# EAGLE design PUCY_E3_wzor (EAGLE 5.08)
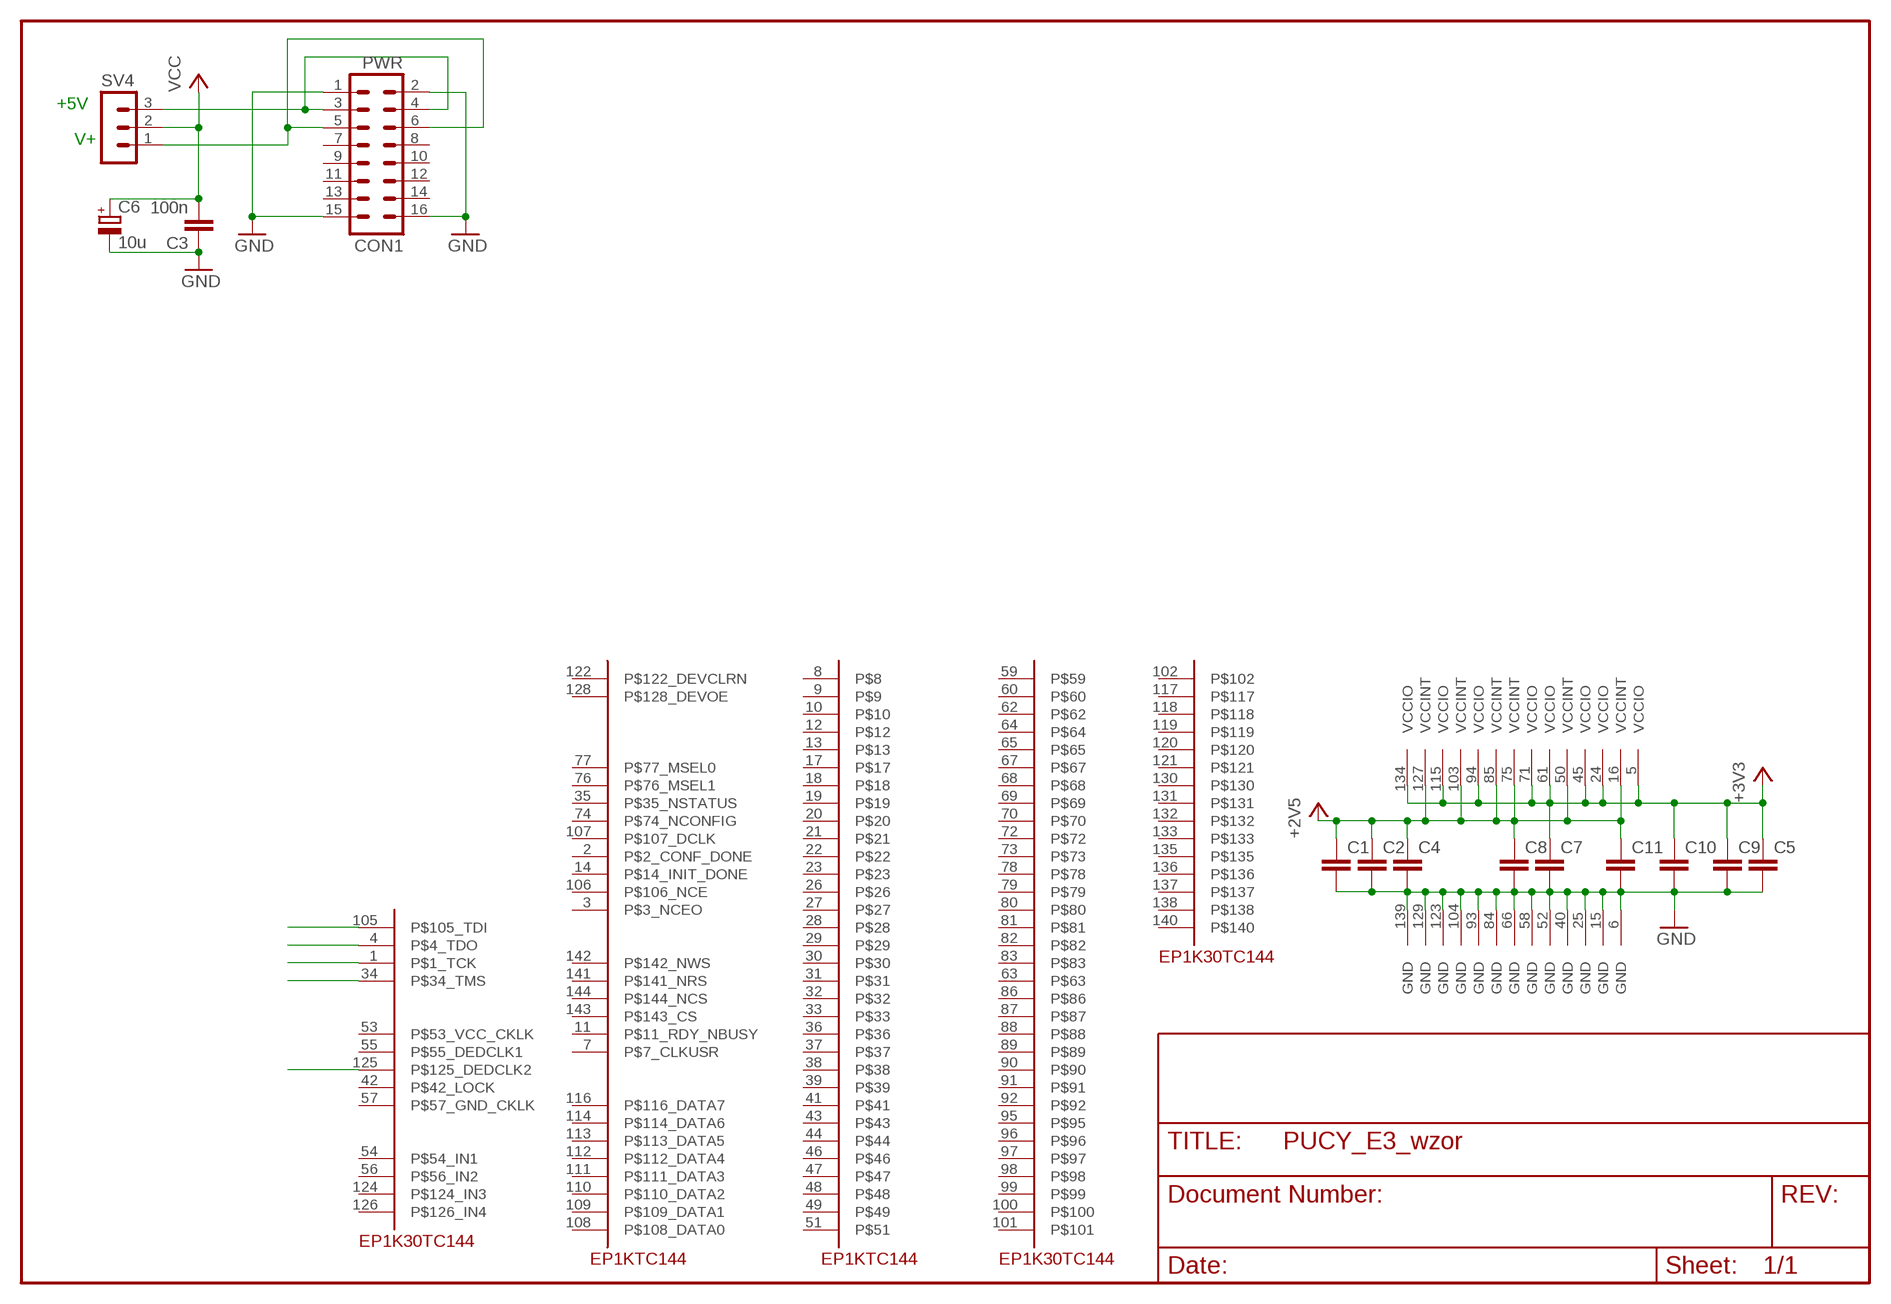
[diagram p0: schematic, sheet 1]

## Parts
C1  C-EUC0805  [C0805]
C2  C-EUC0805  [C0805]
C3  100n  C-EUC0805  [C0805]
C4  C-EUC0805  [C0805]
C5  C-EUC0805  [C0805]
C6  10u  CPOL-EUB/3528-21W  [B/3528-21W]
C7  C-EUC0805  [C0805]
C8  C-EUC0805  [C0805]
C9  C-EUC0805  [C0805]
C10  C-EUC0805  [C0805]
C11  C-EUC0805  [C0805]
CON1  PWR  ML16  [ML16]
SV4  MA03-1  [MA03-1]
U$1  PAWLA_EP1K30TC144  [PAWLA_TQFP144]

## Nets
+3V3: C5.1 C7.1 C9.1 C10.1 U$1.5(VCCIO) U$1.24(VCCIO) U$1.45(VCCIO) U$1.61(VCCIO) U$1.71(VCCIO) U$1.94(VCCIO) U$1.115(VCCIO) U$1.134(VCCIO)
+5V: C1.1 C2.1 C4.1 C8.1 C11.1 U$1.16(VCCINT) U$1.50(VCCINT) U$1.75(VCCINT) U$1.85(VCCINT) U$1.103(VCCINT) U$1.127(VCCINT) ; supply symbol labelled +2V5
GND: C1.2 C2.2 C3.1 C4.2 C5.2 C6.- C7.2 C8.2 C9.2 C10.2 C11.2 CON1.1 CON1.2 CON1.15 CON1.16 U$1.6(GND) U$1.15(GND) U$1.25(GND) U$1.40(GND) U$1.52(GND) U$1.58(GND) U$1.66(GND) U$1.84(GND) U$1.93(GND) U$1.104(GND) U$1.123(GND) U$1.129(GND) U$1.139(GND)
N$1: U$1.125(P$125_DEDCLK2)
N$3: U$1.1(P$1_TCK)
N$4: CON1.5 CON1.6 SV4.1
N$5: U$1.34(P$34_TMS)
N$6: U$1.4(P$4_TDO)
N$7: U$1.105(P$105_TDI)
N$8: CON1.3 CON1.4 SV4.3
VCC: C3.2 C6.+ SV4.2
Unconnected: CON1.7 CON1.8 CON1.9 CON1.10 CON1.11 CON1.12 CON1.13 CON1.14 U$1.2(P$2_CONF_DONE) U$1.3(P$3_NCEO) U$1.7(P$7_CLKUSR) U$1.8 U$1.9 U$1.10 U$1.11(P$11_RDY_NBUSY) U$1.12 U$1.13 U$1.14(P$14_INIT_DONE) U$1.17 U$1.18 U$1.19 U$1.20 U$1.21 U$1.22 U$1.23 U$1.26 U$1.27 U$1.28 U$1.29 U$1.30 U$1.31 U$1.32 U$1.33 U$1.35(P$35_NSTATUS) U$1.36 U$1.37 U$1.38 U$1.39 U$1.41 U$1.42(P$42_LOCK) U$1.43 U$1.44 U$1.46 U$1.47 U$1.48 U$1.49 U$1.51 U$1.53(P$53_VCC_CKLK) U$1.54(P$54_IN1) U$1.55(P$55_DEDCLK1) U$1.56(P$56_IN2) U$1.57(P$57_GND_CKLK) U$1.59 U$1.60 U$1.62 U$1.63 U$1.64 U$1.65 U$1.67 U$1.68 U$1.69 U$1.70 U$1.72 U$1.73 U$1.74(P$74_NCONFIG) U$1.76(P$76_MSEL1) U$1.77(P$77_MSEL0) U$1.78 U$1.79 U$1.80 U$1.81 U$1.82 U$1.83 U$1.86 U$1.87 U$1.88 U$1.89 U$1.90 U$1.91 U$1.92 U$1.95 U$1.96 U$1.97 U$1.98 U$1.99 U$1.100 U$1.101 U$1.102 U$1.106(P$106_NCE) U$1.107(P$107_DCLK) U$1.108(P$108_DATA0) U$1.109(P$109_DATA1) U$1.110(P$110_DATA2) U$1.111(P$111_DATA3) U$1.112(P$112_DATA4) U$1.113(P$113_DATA5) U$1.114(P$114_DATA6) U$1.116(P$116_DATA7) U$1.117 U$1.118 U$1.119 U$1.120 U$1.121 U$1.122(P$122_DEVCLRN) U$1.124(P$124_IN3) U$1.126(P$126_IN4) U$1.128(P$128_DEVOE) U$1.130 U$1.131 U$1.132 U$1.133 U$1.135 U$1.136 U$1.137 U$1.138 U$1.140 U$1.141(P$141_NRS) U$1.142(P$142_NWS) U$1.143(P$143_CS) U$1.144(P$144_NCS)

## Notes on the sheet
- +5V
- V+

## Library data of the parts
C1 C2 C4 C5 C7-C11 = resistor:C-EU: CAPACITOR, European symbol
C3 = rcl:C-EU: CAPACITOR, European symbol
C6 = rcl:CPOL-EU: POLARIZED CAPACITOR, European symbol
CON1 = con-ml:ML16: HARTING
SV4 = con-lstb:MA03-1: PIN HEADER
U$1 = EP1K30TC144:PAWLA_EP1K30TC144

## Board
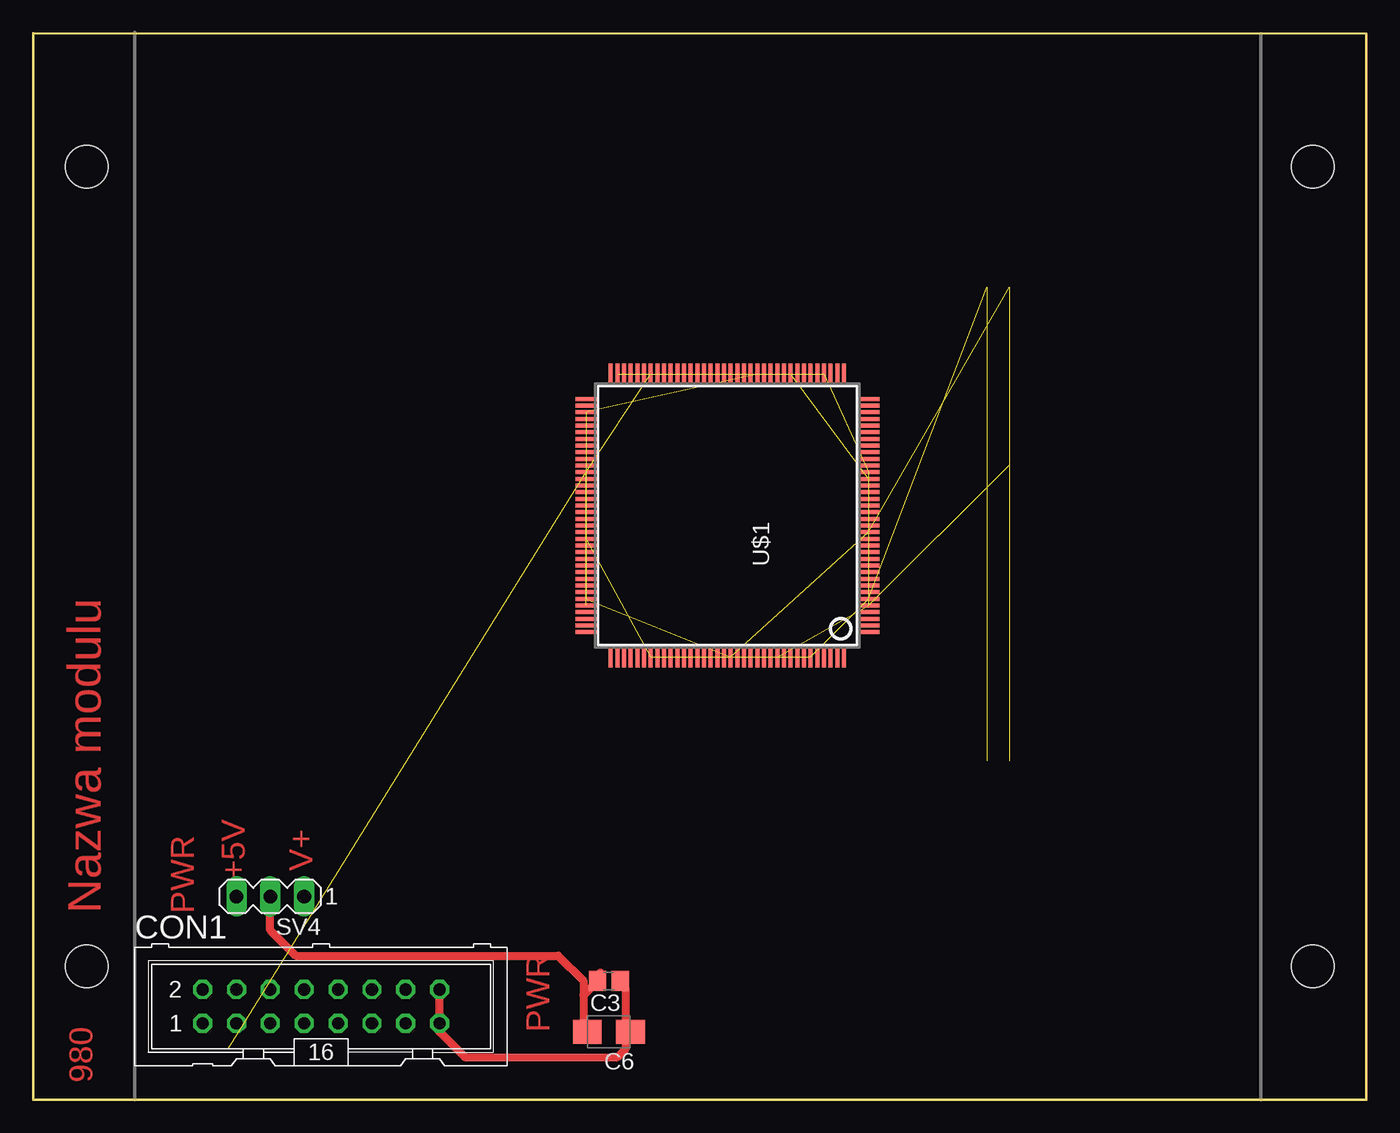
[diagram p1: board, top side]
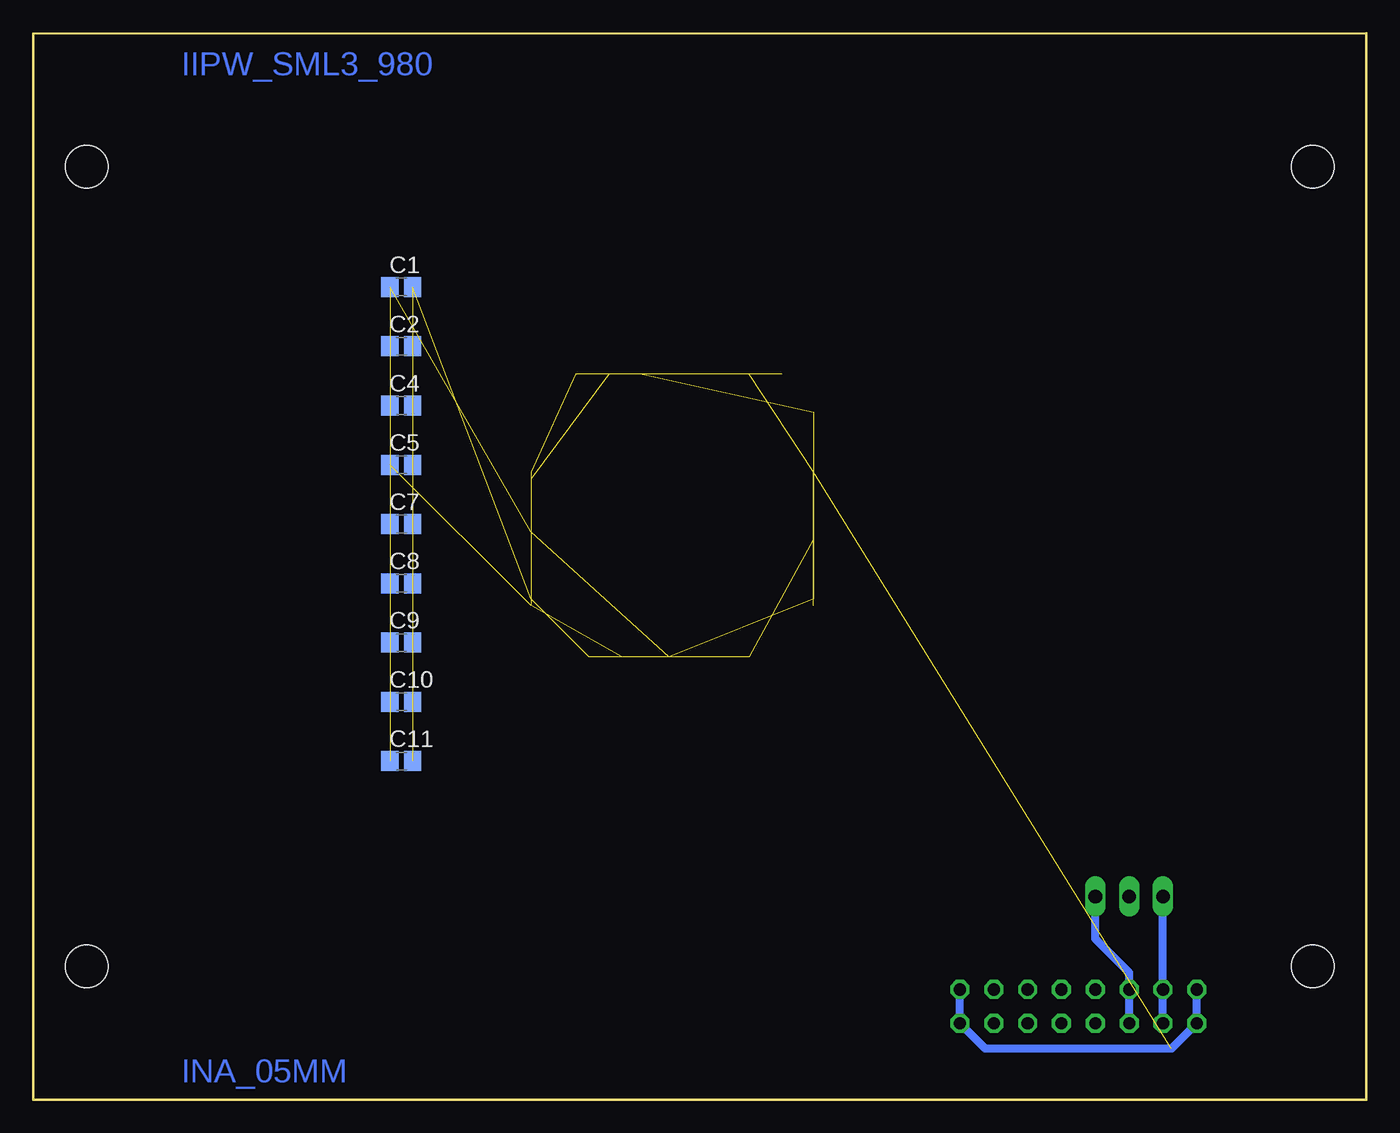
[diagram p2: board, bottom side, seen from below]

Size 100 x 80 mm. Coordinates in mm from the lower left corner, seen from the top.
Outline: 0,0 100,0 100,79.98 0,80 0,0
Copper layers (1*16): Top 0.035mm / dielectric 1.5mm / Bottom 0.035mm
Design rules "default": minimum track width 10mil, minimum drill 24mil, track to track 8mil, track to pad 8mil, pad to pad 8mil, via to via 8mil, smd to smd 8mil, copper to edge 40mil, drill to drill 8mil, minimum pad ring 10mil, minimum via ring 8mil, stop-mask expansion 4mil, vias tented up to drill 0mil, thermal gap 10mil
Holes 3.2 mm at 4,10 4,70 96,10 96,70

### Footprints (pad centres in the part's own frame; a part is rotated, then mirrored left to right if it is on the bottom)
C0805 = smd 1.3 x 1.5: 1 -0.85,0; 2 0.85,0
B/3528-21W = smd 2.15 x 1.8: + 1.625,0; - -1.625,0
ML16 = drill 0.914 octagon: 1 -8.89,-1.27; 2 -8.89,1.27; 3 -6.35,-1.27; 4 -6.35,1.27; 5 -3.81,-1.27; 6 -3.81,1.27; 7 -1.27,-1.27; 8 -1.27,1.27; 9 1.27,-1.27; 10 1.27,1.27; 11 3.81,-1.27; 12 3.81,1.27; 13 6.35,-1.27; 14 6.35,1.27; 15 8.89,-1.27; 16 8.89,1.27
MA03-1 = drill 1.016 long: 1 -2.54,0; 2 0,0; 3 2.54,0
PAWLA_TQFP144 = smd 0.3 x 1.6: 1 -8.75,-10.6; 2 -8.25,-10.6; 3 -7.75,-10.6; 4 -7.25,-10.6; 5 -6.75,-10.6; 6 -6.25,-10.6; 7 -5.75,-10.6; 8 -5.25,-10.6; 9 -4.75,-10.6; 10 -4.25,-10.6; 11 -3.75,-10.6; 12 -3.25,-10.6; 13 -2.75,-10.6; 14 -2.25,-10.6; 15 -1.75,-10.6; 16 -1.25,-10.6; 17 -0.75,-10.6; 18 -0.25,-10.6; 19 0.25,-10.6; 20 0.75,-10.6; 21 1.25,-10.6; 22 1.75,-10.6; 23 2.25,-10.6; 24 2.75,-10.6; 25 3.25,-10.6; 26 3.75,-10.6; 27 4.25,-10.6; 28 4.75,-10.6; 29 5.25,-10.6; 30 5.75,-10.6; 31 6.25,-10.6; 32 6.75,-10.6; 33 7.25,-10.6; 34 7.75,-10.6; 35 8.25,-10.6; 36 8.75,-10.6; 73 8.75,10.6; 74 8.25,10.6; 75 7.75,10.6; 76 7.25,10.6; 77 6.75,10.6; 78 6.25,10.6; 79 5.75,10.6; 80 5.25,10.6; 81 4.75,10.6; 82 4.25,10.6; 83 3.75,10.6; 84 3.25,10.6; 85 2.75,10.6; 86 2.25,10.6; 87 1.75,10.6; 88 1.25,10.6; 89 0.75,10.6; 90 0.25,10.6; 91 -0.25,10.6; 92 -0.75,10.6; 93 -1.25,10.6; 94 -1.75,10.6; 95 -2.25,10.6; 96 -2.75,10.6; 97 -3.25,10.6; 98 -3.75,10.6; 99 -4.25,10.6; 100 -4.75,10.6; 101 -5.25,10.6; 102 -5.75,10.6; 103 -6.25,10.6; 104 -6.75,10.6; 105 -7.25,10.6; 106 -7.75,10.6; 107 -8.25,10.6; 108 -8.75,10.6 | smd 1.6 x 0.3: 37 10.6,-8.75; 38 10.6,-8.25; 39 10.6,-7.75; 40 10.6,-7.25; 41 10.6,-6.75; 42 10.6,-6.25; 43 10.6,-5.75; 44 10.6,-5.25; 45 10.6,-4.75; 46 10.6,-4.25; 47 10.6,-3.75; 48 10.6,-3.25; 49 10.6,-2.75; 50 10.6,-2.25; 51 10.6,-1.75; 52 10.6,-1.25; 53 10.6,-0.75; 54 10.6,-0.25; 55 10.6,0.25; 56 10.6,0.75; 57 10.6,1.25; 58 10.6,1.75; 59 10.6,2.25; 60 10.6,2.75; 61 10.6,3.25; 62 10.6,3.75; 63 10.6,4.25; 64 10.6,4.75; 65 10.6,5.25; 66 10.6,5.75; 67 10.6,6.25; 68 10.6,6.75; 69 10.6,7.25; 70 10.6,7.75; 71 10.6,8.25; 72 10.6,8.75; 109 -10.6,8.75; 110 -10.6,8.25; 111 -10.6,7.75; 112 -10.6,7.25; 113 -10.6,6.75; 114 -10.6,6.25; 115 -10.6,5.75; 116 -10.6,5.25; 117 -10.6,4.75; 118 -10.6,4.25; 119 -10.6,3.75; 120 -10.6,3.25; 121 -10.6,2.75; 122 -10.6,2.25; 123 -10.6,1.75; 124 -10.6,1.25; 125 -10.6,0.75; 126 -10.6,0.25; 127 -10.6,-0.25; 128 -10.6,-0.75; 129 -10.6,-1.25; 130 -10.6,-1.75; 131 -10.6,-2.25; 132 -10.6,-2.75; 133 -10.6,-3.25; 134 -10.6,-3.75; 135 -10.6,-4.25; 136 -10.6,-4.75; 137 -10.6,-5.25; 138 -10.6,-5.75; 139 -10.6,-6.25; 140 -10.6,-6.75; 141 -10.6,-7.25; 142 -10.6,-7.75; 143 -10.6,-8.25; 144 -10.6,-8.75

### Placement (x,y rotation side)
C1  72.39,60.96 0 bottom
C2  72.39,56.52 0 bottom
C3  43.18,8.89 180 top
C4  72.39,52.07 0 bottom
C5  72.39,47.62 0 bottom
C6  43.18,5.08 180 top
C7  72.39,43.18 0 bottom
C8  72.39,38.73 0 bottom
C9  72.39,34.29 0 bottom
C10  72.39,29.84 0 bottom
C11  72.39,25.4 0 bottom
CON1  21.59,6.99 0 top
SV4  17.78,15.24 180 top
U$1  52.07,43.81 90 top

### Tracks (layer width: path | path; a pad name or v marks a point on that pad's centre or on a via)
+3V3  (11 unrouted)
+5V  (10 unrouted)
GND  (22 unrouted)
  Top 0.61: CON1.16 CON1.15 30.48,5.08 32.38,3.17 43.81,3.17 44.45,3.81 44.45,5.08 | 44.45,5.08 C6.- | C3.1 43.81,8.89 44.45,8.26 44.45,5.08
  Bottom 0.61: CON1.16 CON1.15 28.57,3.81 14.61,3.81 CON1.1 CON1.2
N$4
  Bottom 0.61: CON1.5 CON1.6 17.78,9.53 20.32,12.06 SV4.1
N$8
  Bottom 0.61: CON1.3 CON1.4 SV4.3
VCC
  Top 0.61: 42.55,9.53 42.55,8.89 C3.2 41.27,7.83 | C6.+ 41.27,5.08 41.27,7.83 | 41.27,7.83 41.27,8.89 39.37,10.79 19.68,10.79 17.78,12.7 SV4.2

### Text on the board
Top: +5V | V+ | Nazwa modulu | PWR | PWR | 980
Bottom: IIPW_SML3_980 | INA_05MM